# EAGLE schematic Switch_Headphone_Expansion (EAGLE 9.6.2)
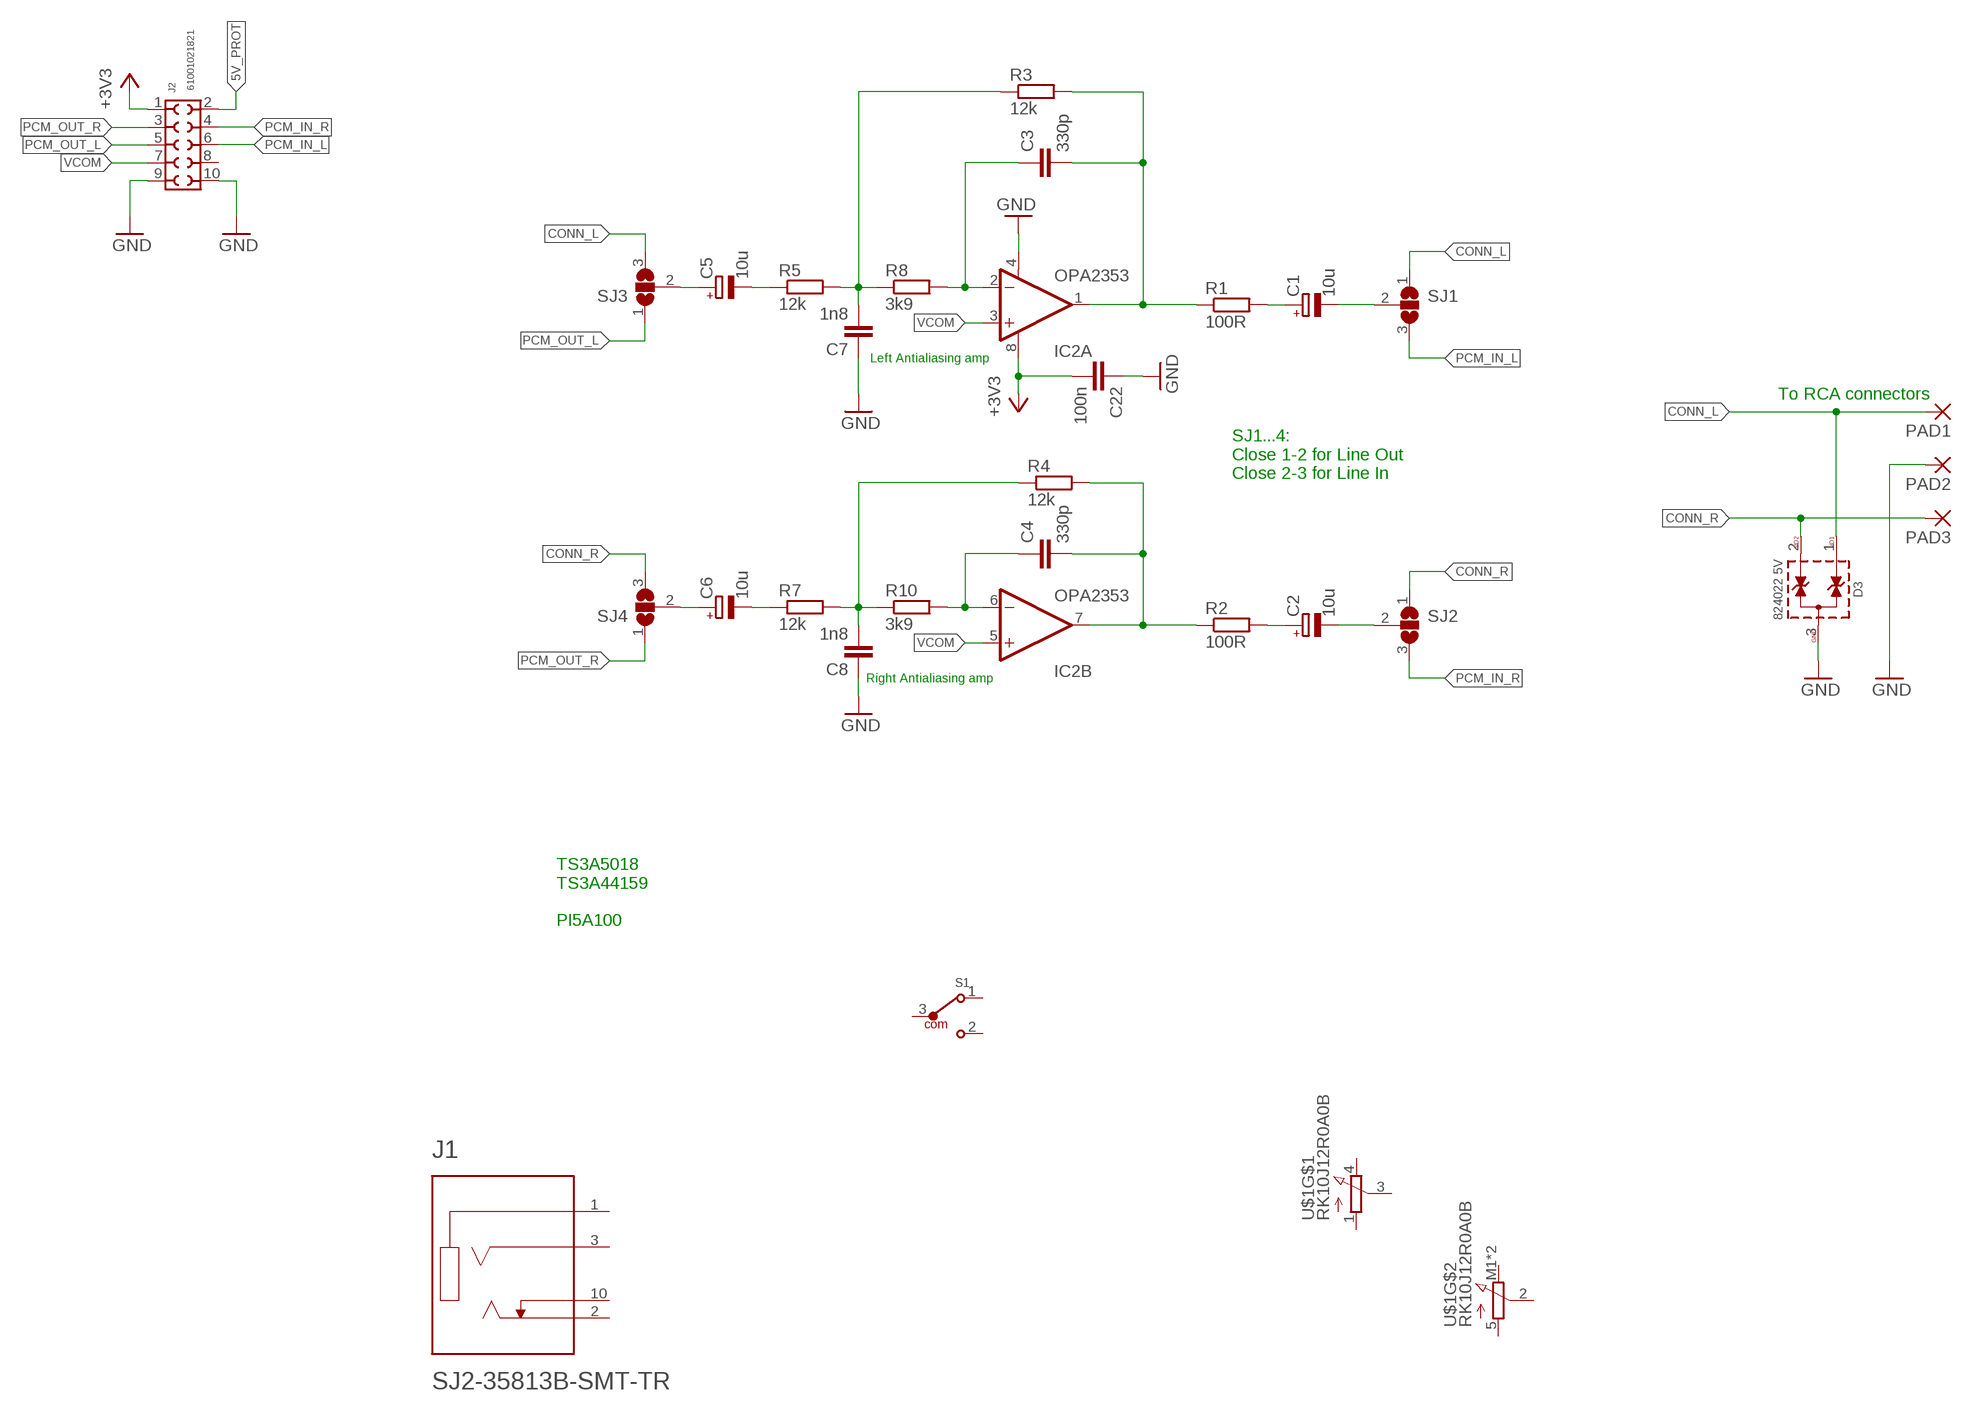
[diagram p0: schematic, sheet 1]

## Parts
C1  10u  CPOL-EUUD-4X5,8  [UD-4X5,8_NICHICON]
C2  10u  CPOL-EUUD-4X5,8  [UD-4X5,8_NICHICON]
C3  330p  C-EUC0603  [C0603]
C4  330p  C-EUC0603  [C0603]
C5  10u  CPOL-EUUD-4X5,8  [UD-4X5,8_NICHICON]
C6  10u  CPOL-EUUD-4X5,8  [UD-4X5,8_NICHICON]
C7  1n8  C-EUC0603  [C0603]
C8  1n8  C-EUC0603  [C0603]
C22  100n  C-EUC0603  [C0603]
D3  824022 5V  WE-TVS_SOT23-3L_824022  [WE-TVS_SOT23-3L]
IC2  OPA2353  OPA2340U  [SO08]
J1  SJ2-35813B-SMT-TR  [CUI_SJ2-35813B-SMT-TR]
J2  61001021821  6100XX21821_61001021821  [61001021821]
PAD1  2,15/1,0  [2,15/1,0]
PAD2  2,15/1,0  [2,15/1,0]
PAD3  2,15/1,0  [2,15/1,0]
R1  100R  R-EU_R0603  [R0603]
R2  100R  R-EU_R0603  [R0603]
R3  12k  R-EU_R0603  [R0603]
R4  12k  R-EU_R0603  [R0603]
R5  12k  R-EU_R0603  [R0603]
R7  12k  R-EU_R0603  [R0603]
R8  3k9  R-EU_R0603  [R0603]
R10  3k9  R-EU_R0603  [R0603]
S1  450405020524  [450405020524]
SJ1  SJ2W  [SJ_2]
SJ2  SJ2W  [SJ_2]
SJ3  SJ2W  [SJ_2]
SJ4  SJ2W  [SJ_2]
U$1  RK10J12R0A0B  [RK10J12R0A0B]

## Nets
5V_PROT: J2.2
+3V3: C22.2 IC2.8(A:V+) J2.1
CONN_L: D3.1(I/O1) PAD1.1(P) SJ1.1 SJ3.3
CONN_R: D3.2(I/O2) PAD3.1(P) SJ2.1 SJ4.3
GND: C7.1 C8.1 C22.1 D3.3(GND) IC2.4(A:V-) J2.9 PAD2.1(P)
N$1: C3.2 IC2.1(A:OUT) R1.1 R3.2
N$2: J2.10 ; supply symbol labelled GND
N$3: C4.2 IC2.7(B:OUT) R2.1 R4.2
N$4: C3.1 IC2.2(A:-IN) R8.2
N$6: C7.2 R3.1 R5.2 R8.1
N$7: C5.- R5.1
N$8: C1.+ R1.2
N$11: C2.+ R2.2
N$12: C4.1 IC2.6(B:-IN) R10.2
N$13: C8.2 R4.1 R7.2 R10.1
N$14: C6.- R7.1
N$15: C5.+ SJ3.2
N$26: C6.+ SJ4.2
N$27: C1.- SJ1.2
N$28: C2.- SJ2.2
PCM_IN_L: J2.6 SJ1.3
PCM_IN_R: J2.4 SJ2.3
PCM_OUT_L: J2.5 SJ3.1
PCM_OUT_R: J2.3 SJ4.1
VCOM: IC2.3(A:+IN) IC2.5(B:+IN) J2.7
Unconnected: J1.1(SLEEVE) J1.2(TIP) J1.3(RING) J1.10(TIP_SWITCH) J2.8 S1.1 S1.2 S1.3 U$1.1(A) U$1.2(S) U$1.3(S) U$1.4(E) U$1.5(A) U$1.M1(E) U$1.M2(E)

## Notes on the sheet
- Left Antialiasing amp
- To RCA connectors
- SJ1...4:
  Close 1-2 for Line Out
  Close 2-3 for Line In
- Right Antialiasing amp
- TS3A5018
  TS3A44159
  
  PI5A100

## Library data of the parts
C1 C2 C5 C6 = rcl:CPOL-EU: POLARIZED CAPACITOR, European symbol; SPICEPREFIX: C
C3 C4 C7 C8 C22 = rcl:C-EU: CAPACITOR, European symbol; SPICEPREFIX: C
D3 = Wurth_EMC Components_WE-TVS:WE-TVS_SOT23-3L_824022: WE-TVS TVS Diode – Standard Series Characteristics Fast turn-on Low clamping voltage High ESD withstand voltage Uni- or bidirectional protection Small package Epoxy flame resistant UL94 V-0 Applications DC power supply USB Power Delivery (PD) Headsets and accessories PDAs Digital cameras MP3-Player Touch Panels Notebooks ESD, EFT and Surge Protection ESD protection in accordance with EN 61000-4-2 – 8 kV contact discharge – 15 kV air discharge <https://www.we-online.com/catalog/media/o106433v209%20Family_WE-TVS_Standard.jpg> Details see: https://www.we-online.com/catalog/en/WE-TVS Updated by Ella Wu 2021-12-16 2021(C) Wurth Elektronik; C-CH: 12pF; CHANNELS: 2; DATASHEET-URL: https://www.we-online.com/catalog/datasheet/824022.pdf; IPEAK: 8A; MOUNT: SMT; PART-NUMBER: 824022; VALUE: 5Vdc; VBR: 6.1V
IC2 = burr-brown:OPA2340: Single-Supply, Rail-to-Rail Operational Amplifiers MicroAmplifier(TM) Series; Product Folder:OPA2340; MANUFACTURER: TEXAS INSTRUMENTS; MPN: OPA2340UA
J1 = Eigene-Rietig:SJ2-35813B-SMT-TR: Check availability <https://pricing.snapeda.com/parts/SJ2-35813B-SMT-TR/CUI%20Devices/view-part?ref=eda>; AVAILABILITY: In Stock; CHECK_PRICES: https://www.snapeda.com/parts/SJ2-35813B-SMT-TR/CUI+Devices/view-part/?ref=eda; CUI_PURCHASE_URL: https://www.cuidevices.com/product/interconnect/connectors/audio-connectors/jacks/sj2-35813b-smt-tr?utm_source=snapeda.com&utm_medium=referral&utm_campaign=snapedaBOM; DESCRIPTION: 3.5 mm, Stereo, Right Angle, Surface Mount (SMT), 3 Conductors, 1 Internal Switch, Audio Jack Connector; MF: CUI Devices; MP: SJ2-35813B-SMT-TR; PACKAGE: None; PRICE: None; PURCHASE-URL: https://www.snapeda.com/api/url_track_click_mouser/?unipart_id=911446&manufacturer=CUI Devices&part_name=SJ2-35813B-SMT-TR&search_term=None; SNAPEDA_LINK: https://www.snapeda.com/parts/SJ2-35813B-SMT-TR/CUI+Devices/view-part/?ref=snap
J2 = Wurth_Connectors_WR-PHD:6100XX21821_61001021821: WR-PHD 2.54mm SMT Socket Header ARTICLE PROPERTIES Pins: 4;​ 6;​ 8;​ 10;​ 12;​ 14;​ 16;​ 18;​ 20;​ 22;​ 24;​ 26;​ 28;​ 30;​ 32;​ 34;​ 36;​ 40 KIND PROPERTIES Pitch 2.54 mm Quality Class 3 as per CECC 75 301-802 Rows Dual Gender Socket Header Type Straight MATERIAL PROPERTIES Insulator Material PA9T Insulator Flammability Rating UL94 V-0 Contact Material Copper Alloy Contact Plating Gold Contact Type Stamped GENERAL INFORMATION Operating Temperature -40 up to +105 °C Compliance Lead free / RoHS ELECTRICAL PROPERTIES Rated Current 3 A;​ max. IR 1 3 A Withstanding Voltage 600 V (AC) Contact Resistance 20 mΩ RISO 1000 MΩ PACKAGING PROPERTIES Packaging Tube <https://katalog.we-online.com/media/images/v2/o33206v209%20Family_WR-PHD_610xxx21821.jpg> Details see: http://katalog.we-online.de/en/em/PHD_2_54_SMT_DUAL_SOCKET_HEADER_6100XX21821 Updated by Ella Wu 2019-06-12 2019 (C) Würth Elektronik; DATASHEET-URL: https://www.we-online.com/redexpert/spec/61001021821?ae; GENDER: Socket Header; IR: 3A; MOUNT: SMT; PACKAGING: Tube; PART-NUMBER: 61001021821; PINS: 10; PITCH: 2.54mm; ROWS: Dual; TYPE: Straight; WE-NUMBER: 61001021821
PAD1-PAD3 = wirepad:2,15/1,0: THROUGH-HOLE PAD
R1-R5 R7 R8 R10 = rcl:R-EU_: RESISTOR, European symbol; SPICEPREFIX: R
S1 = Wurth_Switch_WS-SLSU:450405020524: WS-SLSU SMT Mini Slide Switch Same Side Connection 8.7x3.0 mm PROPERTIES Actuator Material PA46 Actuator Flammability Rating UL94 HB Actuator Color Black Frame Material LCP Frame Flammability Rating UL94 V-0 Frame Color Black Contact Material Copper Alloy Contact Plating Silver Terminal Material Copper Alloy Terminal Plating Silver VR 5 V (DC) Contact Resistance Initial 70 mΩ Contact Resistance After Life Test 500 mΩ RISO 100 MΩ Withstanding Voltage 250 V (AC) ELECTRICAL PROPERTIES IR 300 mA MECHANICAL PROPERTIES Operation Force 225 g PACKAGING PROPERTIES Packaging Tape and Reel <https://katalog.we-online.com/media/images/v2/o158949v209%20WS-SLSU-450405020524.jpg> Details see: https://www.we-online.com/catalog/en/WS_SLSU_SMT_MINI_SLIDE_SWITCH_SAME_SIDE_8_7_x_3_0/ Updated by Ella Wu 2020-03-24 2020(C) Wurth Elektronik; DATASHEET-URL: https://www.we-online.com/catalog/datasheet/450405020524.pdf; IR: 300mA; PACKAGING: Tape and Reel; PART-NUMBER: 450405020524; VR: 5V(DC)
SJ1-SJ4 = jumper:SJ2W: SMD solder JUMPER
U$1 = Eigene-Rietig:RK10J12R0A0B